# Altium project PCB_EMG_SN.PrjPcb
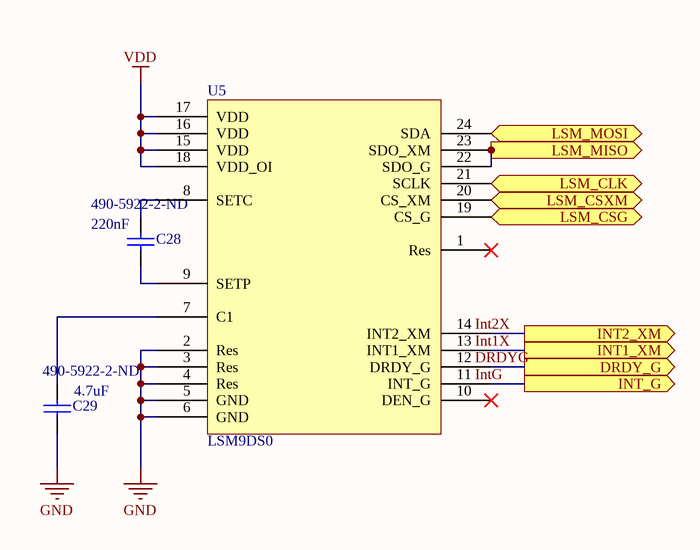
[diagram p0: LSM9DS0.SchDoc]
5 sheets, 67 parts. Net scope: flat (ports and power ports of the same name join across sheets).
Board file: PCB_EMG_SN.PcbDoc
Sheets:
  LSM9DS0.SchDoc
  nRF24L01.SchDoc
  PMU.SchDoc
  AFE_ADS1298.SchDoc
  MCU_MSP430F5529IPN.SchDoc

## Sheet LSM9DS0.SchDoc
size A4

### Parts
C28  value 220nF  Supplier Part Number 1: 490-5922-2-ND  [0402]  (hidden comment: Cap Semi)
C29  value 4.7uF  Supplier Part Number 1: 490-5922-2-ND  [0402]  (hidden comment: Cap Semi)
U5  Component_1  [PCBComponent_1]  (value not drawn)

### Ports
DRDY_G (out), INT1_XM (out), INT2_XM (out), INT_G (out), LSM_CLK (in), LSM_CSG (in), LSM_CSXM (in), LSM_MISO (out), LSM_MOSI (in)

### Nets
GND: C29.1 U5.2(Res) U5.3(Res) U5.4(Res) U5.5(GND) U5.6(GND)  [project net AGND]
VDD: U5.15(VDD) U5.16(VDD) U5.17(VDD) U5.18(VDD_OI)
NetC28_1: C28.1 U5.9(SETP)
NetC28_2: C28.2 U5.8(SETC)
NetC29_2: C29.2 U5.7(C1)
NetU1_9: U5.14(INT2_XM) ; port INT2_XM
NetU1_10: U5.13(INT1_XM) ; port INT1_XM
NetU1_24: U5.19(CS_G) ; port LSM_CSG
NetU1_27: U5.20(CS_XM) ; port LSM_CSXM
NetU1_37: U5.24(SDA) ; port LSM_MOSI
NetU1_38: U5.22(SDO_G) U5.23(SDO_XM) ; port LSM_MISO
NetU1_39: U5.21(SCLK) ; port LSM_CLK
NetU1_69: U5.12(DRDY_G) ; port DRDY_G
NetU1_70: U5.11(INT_G) ; port INT_G

Not connected (* = marked no-connect by the designer): U5 1(Res)* 10(DEN_G)*

### Notes on the sheet
- Labels drawn without touching a wire or pin: DRDYG, Int1X, Int2X, IntG
- (in symbol Component_1) LSM9DS0

### Library data of the parts
C28 C29 = Cap Semi: Capacitor (Semiconductor SIM Model); Published: 8-Jun-2000; LatestRevisionDate: 29-May-2009; LatestRevisionNote: IPC-7351 Footprint Added.; PackageReference: C1206; Publisher: Altium Limited; PackageDescription: Chip Capacitor; Supplier 1: Digi-Key

## Sheet nRF24L01.SchDoc
size A4
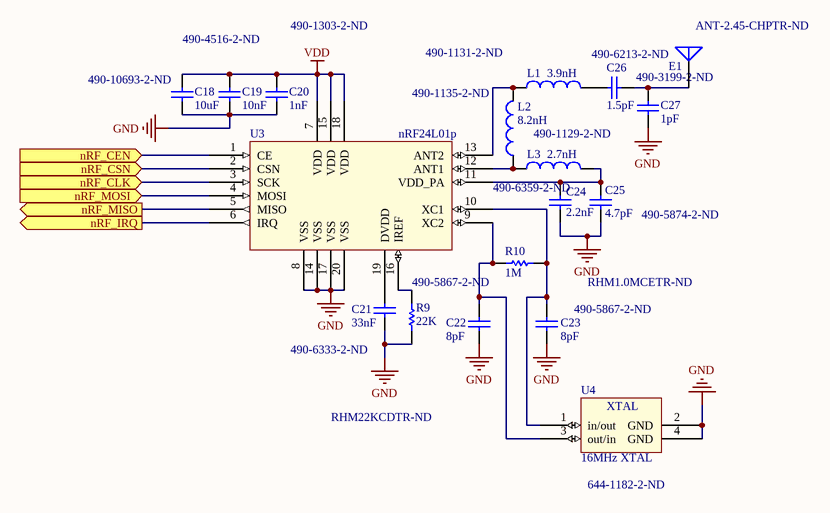
[diagram p1: nRF24L01.SchDoc]

### Parts
C18  value 10uF  Supplier Part Number 1: 490-10693-2-ND  [0402]
C19  value 10nF  Supplier Part Number 1: 490-4516-2-ND  [0402]
C20  value 1nF  Supplier Part Number 1: 490-1303-2-ND  [0402]
C21  value 33nF  Supplier Part Number 1: 490-6333-2-ND  [0402]
C22  value 8pF  Supplier Part Number 1: 490-5867-2-ND  [0402]
C23  value 8pF  Supplier Part Number 1: 490-5867-2-ND  [0402]
C24  value 2.2nF  Supplier Part Number 1: 490-6359-2-ND  [0402]
C25  value 4.7pF  Supplier Part Number 1: 490-5874-2-ND  [0402]
C26  value 1.5pF  Supplier Part Number 1: 490-6213-2-ND  [0402]
C27  value 1pF  Supplier Part Number 1: 490-3199-2-ND  [0402]
E1  Supplier Part Number 1: ANT-2.45-CHPTR-ND  [ANT-2.45-CHP-B]
L1  value 3.9nH  Supplier Part Number 1: 490-1131-2-ND  [0402]
L2  value 8.2nH  Supplier Part Number 1: 490-1135-2-ND  [0402]
L3  value 2.7nH  Supplier Part Number 1: 490-1129-2-ND  [0402]
R9  value 22K  Supplier Part Number 1: RHM22KCDTR-ND  [0402]
R10  value 1M  Supplier Part Number 1: RHM1.0MCETR-ND  [0402]
U3  nRF24L01p  [Component_nRF]
U4  16MHz XTAL  Supplier Part Number 1: 644-1182-2-ND  [8Y-16.000MAAV-T]

### Ports
nRF_CEN (in), nRF_CLK (in), nRF_CSN (in), nRF_IRQ (out), nRF_MISO (out), nRF_MOSI (in)

### Nets
GND: C18.1 C19.1 C20.1 C21.1 C22.1 C23.1 C24.1 C25.1 C27.2 R9.1 U3.8(VSS) U3.14(VSS) U3.17(VSS) U3.20(VSS) U4.2(GND) U4.4(GND)  [project net AGND]
VDD: C18.2 C19.2 C20.2 U3.7(VDD) U3.15(VDD) U3.18(VDD)
NetC21_2: C21.2 U3.19(DVDD)
NetC22_2: C22.2 R10.2 U3.9(XC2) U4.3(out/in)
NetC23_2: C23.2 R10.1 U3.10(XC1) U4.1(in/out)
NetC24_2: C24.2 C25.2 L3.2 U3.11(VDD_PA)
NetC26_1: C26.1 C27.1 E1.1(A)
NetC26_2: C26.2 L1.2
NetL1_1: L1.1 L2.2 U3.13(ANT2)
NetL2_1: L2.1 L3.1 U3.12(ANT1)
NetR9_2: R9.2 U3.16(IREF)
NetU1_32: U3.6(IRQ) ; port nRF_IRQ
NetU1_33: U3.1(CE) ; port nRF_CEN
NetU1_34: U3.2(CSN) ; port nRF_CSN
NetU1_36: U3.3(SCK) ; port nRF_CLK
NetU1_40: U3.4(MOSI) ; port nRF_MOSI
NetU1_41: U3.5(MISO) ; port nRF_MISO

### Notes on the sheet
- (in symbol 8Y-16.000MAAV-T) XTAL

### Library data of the parts
C18-C27 = Cap Semi: Capacitor (Semiconductor SIM Model); Published: 8-Jun-2000; LatestRevisionDate: 29-May-2009; LatestRevisionNote: IPC-7351 Footprint Added.; PackageReference: C1206; Publisher: Altium Limited; PackageDescription: Chip Capacitor; Supplier 1: Digi-Key
E1 = Antenna: Generic Antenna; Published: 24-Mar-1999; LatestRevisionDate: 17-Jul-2002; LatestRevisionNote: Re-released for DXP Platform.; PackageReference: PIN1; Publisher: Altium Limited; Supplier 1: Digi-Key
L1-L3 = Inductor: Code_IEC: 1005; Published: 8-Jun-2000; LatestRevisionDate: 29-May-2009; LatestRevisionNote: IPC-7351 Footprint Added.; PackageReference: 0402-A; Publisher: Altium Limited; PackageDescription: Chip Inductor; Code_JEITA: 0402; Supplier 1: Digi-Key
R9 R10 = Res Semi: Semiconductor Resistor; Published: 8-Jun-2000; LatestRevisionDate: 17-Jul-2002; LatestRevisionNote: Re-released for DXP Platform.; PackageReference: AXIAL-0.5; Publisher: Altium Limited; PackageDescription: Axial Device, Thru-Hole; 2 Leads; 0.5 in Pin Spacing; Supplier 1: Digi-Key
U3 = Component_nRF
U4 = 8Y-16.000MAAV-T: SMD 16 MHz XTAL; Supplier 1: Digi-Key

## Sheet PMU.SchDoc
size A4
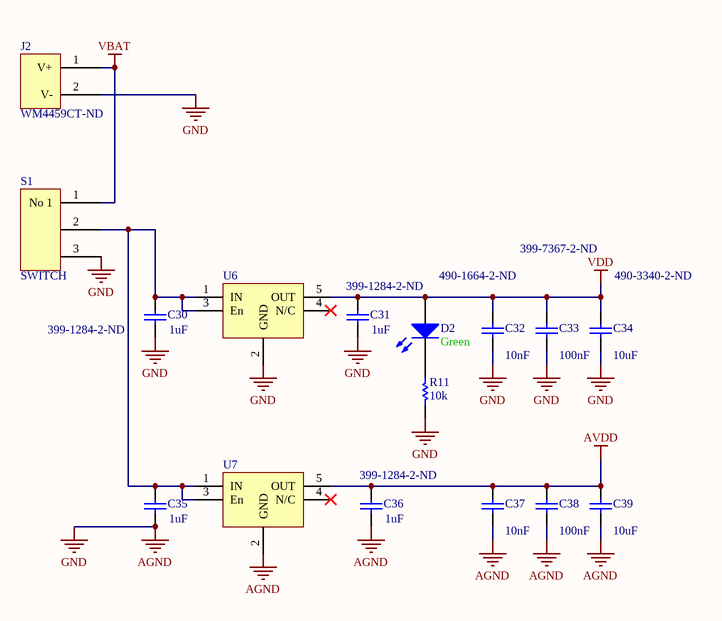
[diagram p2: PMU.SchDoc]

### Parts
C30  value 1uF  Supplier Part Number 1: 399-1284-2-ND  [0402]  (hidden comment: Cap Semi)
C31  value 1uF  Supplier Part Number 1: 399-1284-2-ND  [0402]  (hidden comment: Cap Semi)
C32  value 10nF  Supplier Part Number 1: 490-1664-2-ND  [0402]  (hidden comment: Cap Semi)
C33  value 100nF  Supplier Part Number 1: 399-7367-2-ND  [0402]  (hidden comment: Cap Semi)
C34  value 10uF  Supplier Part Number 1: 490-3340-2-ND  [0402]  (hidden comment: Cap Semi)
C35  value 1uF  [0402]  (hidden comment: Cap Semi)
C36  value 1uF  Supplier Part Number 1: 399-1284-2-ND  [0402]  (hidden comment: Cap Semi)
C37  value 10nF  [0402]  (hidden comment: Cap Semi)
C38  value 100nF  [0402]  (hidden comment: Cap Semi)
C39  value 10uF  [0402]  (hidden comment: Cap Semi)
D2  Color: Green  [0402]
J2  WM4459CT-ND  [WM4459CT-ND]
R11  value 10k  [0402]
S1  SWITCH  [CUS-12B]
U6  Reg 3.3V  [TSOP-5ll]  (value not drawn)
U7  Reg 3.3V  [TSOP-5ll]  (value not drawn)

### Nets
AGND: C30.1 C31.1 C32.1 C33.1 C34.1 C35.1 C36.1 C37.1 C38.1 C39.1 J2.2(V-) R11.2 S1.3 U6.2(GND) U7.2(GND)  [also labelled GND]
AVDD: C36.2 C37.2 C38.2 C39.2 U7.5(OUT)
VBAT: J2.1(V+) S1.1(No_1)
VDD: C31.2 C32.2 C33.2 C34.2 D2.1(A) U6.5(OUT)
NetC30_2: C30.2 C35.2 S1.2 U6.1(IN) U6.3(En) U7.1(IN) U7.3(En)
NetD2_2: D2.2(K) R11.1

Not connected (* = marked no-connect by the designer): U6 4(N/C)*; U7 4(N/C)*

### Library data of the parts
C30-C39 = Cap Semi: Capacitor (Semiconductor SIM Model); Published: 8-Jun-2000; LatestRevisionDate: 29-May-2009; LatestRevisionNote: IPC-7351 Footprint Added.; PackageReference: C1206; Publisher: Altium Limited; PackageDescription: Chip Capacitor; Supplier 1: Digi-Key
  C35: Supplier Part Number 1: 399-1284-2-ND
  C37: Supplier Part Number 1: 490-1664-2-ND
  C38: Supplier Part Number 1: 399-7367-2-ND
  C39: Supplier Part Number 1: 490-3340-2-ND
D2 = LED3: Typical BLUE SiC LED; Published: 8-Jun-2000; LatestRevisionDate: 17-Dec-2003; LatestRevisionNote: PCB Footprint replaced.; DatasheetVersion: 16-Apr-2002; PackageVersion: 16-Apr-2002; PackageReference: 3.5X2.8X1.9; Publisher: Altium Limited; PackageDescription: SM LED; 2 C-Bend Leads; Body 3.5 x 2.8 x 1.9 mm, inc leads (LxWxH typ)
R11 = Res Semi: Semiconductor Resistor; Published: 8-Jun-2000; LatestRevisionDate: 17-Jul-2002; LatestRevisionNote: Re-released for DXP Platform.; PackageReference: AXIAL-0.5; Publisher: Altium Limited; PackageDescription: Axial Device, Thru-Hole; 2 Leads; 0.5 in Pin Spacing
S1 = Component_1
U6 U7 = NCP603SN330T1G: IC REG LDO 3.3V 0.3A 5TSOP; Supplier 1: Digi-Key; Supplier Part Number 1: NCP603SN330T1GOSCT-ND

## Sheet AFE_ADS1298.SchDoc
size A4
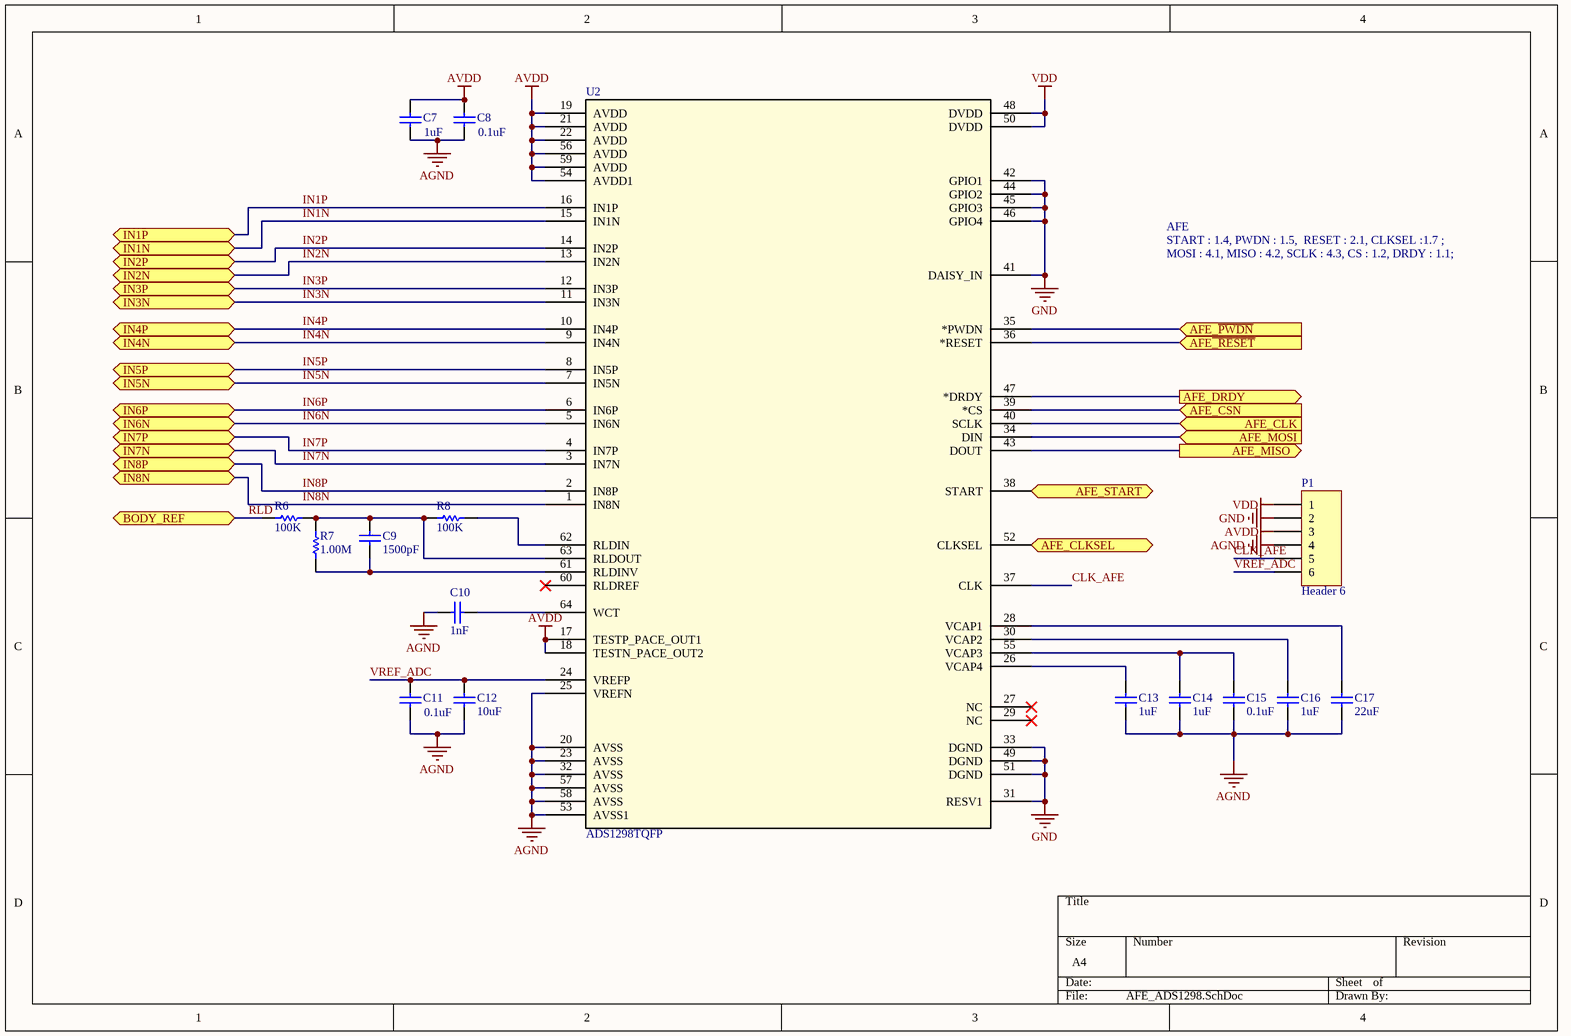
[diagram p3: AFE_ADS1298.SchDoc]

### Parts
C7  value 1uF  [0402]  (hidden comment: Cap)
C8  value 0.1uF  [0402]  (hidden comment: Cap)
C9  value 1500pF  [0402]  (hidden comment: Cap)
C10  value 1nF  [0402]  (hidden comment: Cap)
C11  value 0.1uF  [0402]  (hidden comment: Cap)
C12  value 10uF  [0402]
C13  value 1uF  [0402]  (hidden comment: Cap)
C14  value 1uF  [0402]  (hidden comment: Cap)
C15  value 0.1uF  [0402]  (hidden comment: Cap)
C16  value 1uF  [0402]  (hidden comment: Cap)
C17  value 22uF  [0402]  (hidden comment: Cap)
P1  Header 6  [HDR1X6]
R6  value 100K  [0402]  (hidden comment: Res1)
R7  value 1.00M  [0402]  (hidden comment: Res1)
R8  value 100K  [0402]  (hidden comment: Res1)
U2  ADS1298TQFP  [64TQFP]

### Ports
AFE_CLK (in), AFE_CLKSEL (in), AFE_CSN (in), AFE_DRDY (out), AFE_MISO (out), AFE_MOSI (in), AFE_START (in), AFE_~{PWDN} (in), AFE~{_RESET} (in), BODY_REF (bidir), IN1N (bidir), IN1P (bidir), IN2N (bidir), IN2P (bidir), IN3N (bidir), IN3P (bidir), IN4N (bidir), IN4P (bidir), IN5N (bidir), IN5P (bidir), IN6N (bidir), IN6P (bidir), IN7N (bidir), IN7P (bidir), IN8N (bidir), IN8P (bidir)

### Nets
AGND: C7.1 C8.1 C10.2 C11.1 C12.1 C13.2 C14.2 C15.2 C16.2 C17.2 P1.2 P1.4 U2.20(AVSS) U2.23(AVSS) U2.25(VREFN) U2.31(RESV1) U2.32(AVSS) U2.33(DGND) U2.41(DAISY_IN) U2.42(GPIO1) U2.44(GPIO2) U2.45(GPIO3) U2.46(GPIO4) U2.49(DGND) U2.51(DGND) U2.53(AVSS1) U2.57(AVSS) U2.58(AVSS)  [also labelled GND]
AVDD: C7.2 C8.2 P1.3 U2.17(TESTP_PACE_OUT1) U2.18(TESTN_PACE_OUT2) U2.19(AVDD) U2.21(AVDD) U2.22(AVDD) U2.54(AVDD1) U2.56(AVDD) U2.59(AVDD)
VDD: P1.1 U2.48(DVDD) U2.50(DVDD)
CLK_AFE: P1.5 U2.37(CLK)
IN1N: U2.15(IN1N) ; port IN1N
IN1P: U2.16(IN1P) ; port IN1P
IN2N: U2.13(IN2N) ; port IN2N
IN2P: U2.14(IN2P) ; port IN2P
IN3N: U2.11(IN3N) ; port IN3N
IN3P: U2.12(IN3P) ; port IN3P
IN4N: U2.9(IN4N) ; port IN4N
IN4P: U2.10(IN4P) ; port IN4P
IN5N: U2.7(IN5N) ; port IN5N
IN5P: U2.8(IN5P) ; port IN5P
IN6N: U2.5(IN6N) ; port IN6N
IN6P: U2.6(IN6P) ; port IN6P
IN7N: U2.3(IN7N) ; port IN7N
IN7P: U2.4(IN7P) ; port IN7P
IN8N: U2.1(IN8N) ; port IN8N
IN8P: U2.2(IN8P) ; port IN8P
RLD: R6.2 ; port BODY_REF
VREF_ADC: C11.2 C12.2 P1.6 U2.24(VREFP)
NetC9_1: C9.1 R7.2 U2.61(RLDINV)
NetC9_2: C9.2 R6.1 R7.1 R8.2 U2.63(RLDOUT)
NetC10_1: C10.1 U2.64(WCT)
NetC13_1: C13.1 U2.26(VCAP4)
NetC14_1: C14.1 C15.1 U2.55(VCAP3)
NetC16_1: C16.1 U2.30(VCAP2)
NetC17_1: C17.1 U2.28(VCAP1)
NetR8_1: R8.1 U2.62(RLDIN)
NetU1_22: U2.47(*DRDY) ; port AFE_DRDY
NetU1_23: U2.39(*CS) ; port AFE_CSN
NetU1_25: U2.38(START) ; port AFE_START
NetU1_26: U2.35(*PWDN) ; port AFE_~{PWDN}
NetU1_28: U2.52(CLKSEL) ; port AFE_CLKSEL
NetU1_30: U2.36(*RESET) ; port AFE~{_RESET}
NetU1_46: U2.34(DIN) ; port AFE_MOSI
NetU1_47: U2.43(DOUT) ; port AFE_MISO
NetU1_48: U2.40(SCLK) ; port AFE_CLK

Not connected (* = marked no-connect by the designer): U2 27(NC)* 29(NC)* 60(RLDREF)*

### Notes on the sheet
- AFE
- START : 1.4, PWDN : 1.5,  RESET : 2.1, CLKSEL :1.7 ;
- MOSI : 4.1, MISO : 4.2, SCLK : 4.3, CS : 1.2, DRDY : 1.1;

### Library data of the parts
C7-C11 C13-C17 = Cap: Capacitor
C12 = Cap Semi: Capacitor (Semiconductor SIM Model)
P1 = Header 6: Header, 6-Pin; LatestRevisionDate: 17-Jul-2002; LatestRevisionNote: Re-released for DXP Platform.; Publisher: Altium Limited
R6-R8 = Res1: Resistor
U2 = ADS1298_PAG_64: Imported; Manufacturer: Texas Instruments; INDUSTRY_STD_PKG_TYPE: TQFP; FAMILY_NAME: ECG / EEG Analog Front End; PIN_COUNT: 64; PACKAGE_DESIGNATOR: PAG; Datasheet URL: http://www.ti.com/lit/gpn/ADS1298; GENERIC_PART_NUMBER: ADS1298; RefDes: RefDes; Type: DEV; Value: Value

## Sheet MCU_MSP430F5529IPN.SchDoc
size A4
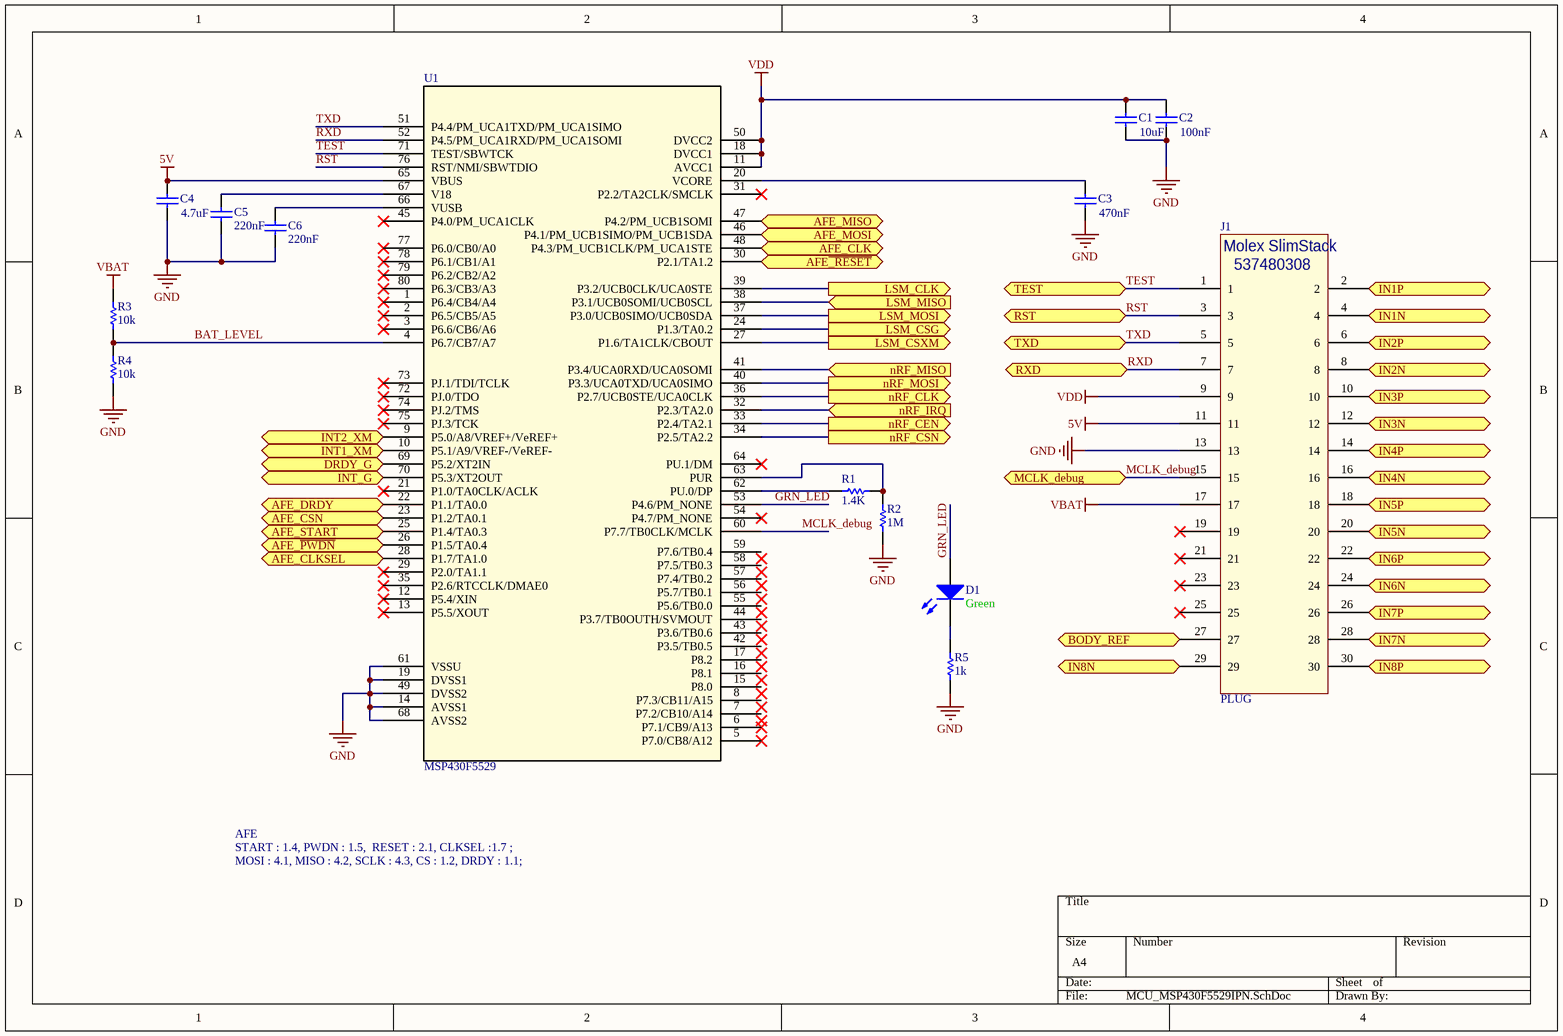
[diagram p4: MCU_MSP430F5529IPN.SchDoc]

### Parts
C1  value 10uF  [0402]  (hidden comment: Cap Semi)
C2  value 100nF  [0402]  (hidden comment: Cap Semi)
C3  value 470nF  [0402]  (hidden comment: Cap Semi)
C4  value 4.7uF  [0402]  (hidden comment: Cap Semi)
C5  value 220nF  [0402]  (hidden comment: Cap Semi)
C6  value 220nF  [0402]  (hidden comment: Cap Semi)
D1  Color: Green  [0402]
J1  PLUG  [Molex 0529910308]
R1  value 1.4K  [0402]
R2  value 1M  [0402]
R3  value 10k  [0402]
R4  value 10k  [0402]
R5  value 1k  [0402]
U1  MSP430F5529  [80-LQFP]

### Ports
AFE_CLK (out), AFE_CLKSEL (out), AFE_CSN (out), AFE_DRDY (in), AFE_MISO (in), AFE_MOSI (out), AFE_START (out), AFE_~{PWDN} (out), AFE~{_RESET} (out), BODY_REF (bidir), DRDY_G (in), IN1N (bidir), IN1P (bidir), IN2N (bidir), IN2P (bidir), IN3N (bidir), IN3P (bidir), IN4N (bidir), IN4P (bidir), IN5N (bidir), IN5P (bidir), IN6N (bidir), IN6P (bidir), IN7N (bidir), IN7P (bidir), IN8N (bidir), IN8P (bidir), INT1_XM (in), INT2_XM (in), INT_G (in), LSM_CLK (out), LSM_CSG (out), LSM_CSXM (out), LSM_MISO (in), LSM_MOSI (out), MCLK_debug (bidir), nRF_CEN (out), nRF_CLK (out), nRF_CSN (out), nRF_IRQ (in), nRF_MISO (in), nRF_MOSI (out), RST (bidir), RXD (bidir), TEST (bidir), TXD (bidir)

### Nets
5V: C4.1 J1.11 U1.65(VBUS)
GND: C1.2 C2.2 C3.2 C4.2 C5.1 C6.1 J1.13 R2.2 R4.1 R5.2 U1.14(AVSS1) U1.19(DVSS1) U1.49(DVSS2) U1.61(VSSU) U1.68(AVSS2)  [project net AGND]
VBAT: J1.17 R3.2
VDD: C1.1 C2.1 J1.9 U1.11(AVCC1) U1.18(DVCC1) U1.50(DVCC2)
BAT_LEVEL: R3.1 R4.2 U1.4(P6.7/CB7/A7)
GRN_LED: D1.1(A) U1.53(P4.6/PM_NONE)
IN1N: J1.4 ; port IN1N
IN1P: J1.2 ; port IN1P
IN2N: J1.8 ; port IN2N
IN2P: J1.6 ; port IN2P
IN3N: J1.12 ; port IN3N
IN3P: J1.10 ; port IN3P
IN4N: J1.16 ; port IN4N
IN4P: J1.14 ; port IN4P
IN5N: J1.20 ; port IN5N
IN5P: J1.18 ; port IN5P
IN6N: J1.24 ; port IN6N
IN6P: J1.22 ; port IN6P
IN7N: J1.28 ; port IN7N
IN7P: J1.26 ; port IN7P
IN8N: J1.29 ; port IN8N
IN8P: J1.30 ; port IN8P
MCLK_debug: J1.15 U1.60(P7.7/TB0CLK/MCLK) ; port MCLK_debug
RLD: J1.27 ; port BODY_REF
RST: J1.3 U1.76(RST/NMI/SBWTDIO) ; port RST
RXD: J1.7 U1.52(P4.5/PM_UCA1RXD/PM_UCA1SOMI) ; port RXD
TEST: J1.1 U1.71(TEST/SBWTCK) ; port TEST
TXD: J1.5 U1.51(P4.4/PM_UCA1TXD/PM_UCA1SIMO) ; port TXD
NetC3_1: C3.1 U1.20(VCORE)
NetC5_2: C5.2 U1.67(V18)
NetC6_2: C6.2 U1.66(VUSB)
NetD1_2: D1.2(K) R5.1
NetR1_1: R1.1 R2.1 U1.63(PUR)
NetR1_2: R1.2 U1.62(PU.0/DP)
NetU1_9: U1.9(P5.0/A8/VREF+/VeREF+) ; port INT2_XM
NetU1_10: U1.10(P5.1/A9/VREF-/VeREF-) ; port INT1_XM
NetU1_22: U1.22(P1.1/TA0.0) ; port AFE_DRDY
NetU1_23: U1.23(P1.2/TA0.1) ; port AFE_CSN
NetU1_24: U1.24(P1.3/TA0.2) ; port LSM_CSG
NetU1_25: U1.25(P1.4/TA0.3) ; port AFE_START
NetU1_26: U1.26(P1.5/TA0.4) ; port AFE_~{PWDN}
NetU1_27: U1.27(P1.6/TA1CLK/CBOUT) ; port LSM_CSXM
NetU1_28: U1.28(P1.7/TA1.0) ; port AFE_CLKSEL
NetU1_30: U1.30(P2.1/TA1.2) ; port AFE~{_RESET}
NetU1_32: U1.32(P2.3/TA2.0) ; port nRF_IRQ
NetU1_33: U1.33(P2.4/TA2.1) ; port nRF_CEN
NetU1_34: U1.34(P2.5/TA2.2) ; port nRF_CSN
NetU1_36: U1.36(P2.7/UCB0STE/UCA0CLK) ; port nRF_CLK
NetU1_37: U1.37(P3.0/UCB0SIMO/UCB0SDA) ; port LSM_MOSI
NetU1_38: U1.38(P3.1/UCB0SOMI/UCB0SCL) ; port LSM_MISO
NetU1_39: U1.39(P3.2/UCB0CLK/UCA0STE) ; port LSM_CLK
NetU1_40: U1.40(P3.3/UCA0TXD/UCA0SIMO) ; port nRF_MOSI
NetU1_41: U1.41(P3.4/UCA0RXD/UCA0SOMI) ; port nRF_MISO
NetU1_46: U1.46(P4.1/PM_UCB1SIMO/PM_UCB1SDA) ; port AFE_MOSI
NetU1_47: U1.47(P4.2/PM_UCB1SOMI) ; port AFE_MISO
NetU1_48: U1.48(P4.3/PM_UCB1CLK/PM_UCA1STE) ; port AFE_CLK
NetU1_69: U1.69(P5.2/XT2IN) ; port DRDY_G
NetU1_70: U1.70(P5.3/XT2OUT) ; port INT_G

Not connected (* = marked no-connect by the designer): J1 19* 21* 23* 25*; U1 1(P6.4/CB4/A4)* 2(P6.5/CB5/A5)* 3(P6.6/CB6/A6)* 5(P7.0/CB8/A12)* 6(P7.1/CB9/A13)* 7(P7.2/CB10/A14) 8(P7.3/CB11/A15) 12(P5.4/XIN)* 13(P5.5/XOUT)* 15(P8.0) 16(P8.1) 17(P8.2) 21(P1.0/TA0CLK/ACLK)* 29(P2.0/TA1.1)* 31(P2.2/TA2CLK/SMCLK)* 35(P2.6/RTCCLK/DMAE0)* 42(P3.5/TB0.5) 43(P3.6/TB0.6) 44(P3.7/TB0OUTH/SVMOUT) 45(P4.0/PM_UCA1CLK)* 54(P4.7/PM_NONE)* 55(P5.6/TB0.0) 56(P5.7/TB0.1) 57(P7.4/TB0.2) 58(P7.5/TB0.3) 59(P7.6/TB0.4) 64(PU.1/DM)* 72(PJ.0/TDO)* 73(PJ.1/TDI/TCLK)* 74(PJ.2/TMS)* 75(PJ.3/TCK)* 77(P6.0/CB0/A0)* 78(P6.1/CB1/A1)* 79(P6.2/CB2/A2)* 80(P6.3/CB3/A3)*

### Notes on the sheet
- AFE
- START : 1.4, PWDN : 1.5,  RESET : 2.1, CLKSEL :1.7 ;
- MOSI : 4.1, MISO : 4.2, SCLK : 4.3, CS : 1.2, DRDY : 1.1;
- (in symbol Molex 529910308) Molex SlimStack; 537480308

### Library data of the parts
C1-C6 = Cap Semi: Capacitor (Semiconductor SIM Model); Published: 8-Jun-2000; LatestRevisionDate: 29-May-2009; LatestRevisionNote: IPC-7351 Footprint Added.; PackageReference: C1206; Publisher: Altium Limited; PackageDescription: Chip Capacitor; Supplier 1: Digi-Key
  C1 C2: Supplier Part Number 1: 490-10692-2-ND
  C3: Supplier Part Number 1: 1276-1734-2-ND
  C4: Supplier Part Number 1: 490-5915-2-ND
  C5 C6: Supplier Part Number 1: 490-3884-2-ND
D1 = LED3: Typical BLUE SiC LED; Published: 8-Jun-2000; LatestRevisionDate: 17-Dec-2003; LatestRevisionNote: PCB Footprint replaced.; DatasheetVersion: 16-Apr-2002; PackageVersion: 16-Apr-2002; PackageReference: 3.5X2.8X1.9; Publisher: Altium Limited; PackageDescription: SM LED; 2 C-Bend Leads; Body 3.5 x 2.8 x 1.9 mm, inc leads (LxWxH typ)
J1 = Molex 529910308
R1-R5 = Res Semi: Semiconductor Resistor; Published: 8-Jun-2000; LatestRevisionDate: 17-Jul-2002; LatestRevisionNote: Re-released for DXP Platform.; PackageReference: AXIAL-0.5; Publisher: Altium Limited; PackageDescription: Axial Device, Thru-Hole; 2 Leads; 0.5 in Pin Spacing; Supplier 1: Digi-Key
  R1 R3 R4: Supplier Part Number 1: RHM1.4KBHTR-ND
  R2: Supplier Part Number 1: RHM1.00MCDTR-ND
  R5: Supplier Part Number 1: RHM100CDTR-ND
U1 = MSP430F5529: IC MCU 16BIT 128KB FLASH 80LQFP; Supplier 1: Digi-Key; Supplier Part Number 1: 296-25427-ND

## Nets that join several sheets
AGND: LSM9DS0 (6 pins), nRF24L01 (16 pins), PMU (15 pins), AFE_ADS1298 (28 pins), MCU_MSP430F5529IPN (15 pins)
AVDD: PMU (5 pins), AFE_ADS1298 (11 pins)
VBAT: PMU (J2.1 S1.1), MCU_MSP430F5529IPN (J1.17 R3.2)
VDD: LSM9DS0 (U5.15 U5.16 U5.17 U5.18), nRF24L01 (6 pins), PMU (6 pins), AFE_ADS1298 (P1.1 U2.48 U2.50), MCU_MSP430F5529IPN (6 pins)
IN1N: AFE_ADS1298 (U2.15), MCU_MSP430F5529IPN (J1.4)
IN1P: AFE_ADS1298 (U2.16), MCU_MSP430F5529IPN (J1.2)
IN2N: AFE_ADS1298 (U2.13), MCU_MSP430F5529IPN (J1.8)
IN2P: AFE_ADS1298 (U2.14), MCU_MSP430F5529IPN (J1.6)
IN3N: AFE_ADS1298 (U2.11), MCU_MSP430F5529IPN (J1.12)
IN3P: AFE_ADS1298 (U2.12), MCU_MSP430F5529IPN (J1.10)
IN4N: AFE_ADS1298 (U2.9), MCU_MSP430F5529IPN (J1.16)
IN4P: AFE_ADS1298 (U2.10), MCU_MSP430F5529IPN (J1.14)
IN5N: AFE_ADS1298 (U2.7), MCU_MSP430F5529IPN (J1.20)
IN5P: AFE_ADS1298 (U2.8), MCU_MSP430F5529IPN (J1.18)
IN6N: AFE_ADS1298 (U2.5), MCU_MSP430F5529IPN (J1.24)
IN6P: AFE_ADS1298 (U2.6), MCU_MSP430F5529IPN (J1.22)
IN7N: AFE_ADS1298 (U2.3), MCU_MSP430F5529IPN (J1.28)
IN7P: AFE_ADS1298 (U2.4), MCU_MSP430F5529IPN (J1.26)
IN8N: AFE_ADS1298 (U2.1), MCU_MSP430F5529IPN (J1.29)
IN8P: AFE_ADS1298 (U2.2), MCU_MSP430F5529IPN (J1.30)
NetU1_9: LSM9DS0 (U5.14), MCU_MSP430F5529IPN (U1.9)
NetU1_10: LSM9DS0 (U5.13), MCU_MSP430F5529IPN (U1.10)
NetU1_22: AFE_ADS1298 (U2.47), MCU_MSP430F5529IPN (U1.22)
NetU1_23: AFE_ADS1298 (U2.39), MCU_MSP430F5529IPN (U1.23)
NetU1_24: LSM9DS0 (U5.19), MCU_MSP430F5529IPN (U1.24)
NetU1_25: AFE_ADS1298 (U2.38), MCU_MSP430F5529IPN (U1.25)
NetU1_26: AFE_ADS1298 (U2.35), MCU_MSP430F5529IPN (U1.26)
NetU1_27: LSM9DS0 (U5.20), MCU_MSP430F5529IPN (U1.27)
NetU1_28: AFE_ADS1298 (U2.52), MCU_MSP430F5529IPN (U1.28)
NetU1_30: AFE_ADS1298 (U2.36), MCU_MSP430F5529IPN (U1.30)
NetU1_32: nRF24L01 (U3.6), MCU_MSP430F5529IPN (U1.32)
NetU1_33: nRF24L01 (U3.1), MCU_MSP430F5529IPN (U1.33)
NetU1_34: nRF24L01 (U3.2), MCU_MSP430F5529IPN (U1.34)
NetU1_36: nRF24L01 (U3.3), MCU_MSP430F5529IPN (U1.36)
NetU1_37: LSM9DS0 (U5.24), MCU_MSP430F5529IPN (U1.37)
NetU1_38: LSM9DS0 (U5.22 U5.23), MCU_MSP430F5529IPN (U1.38)
NetU1_39: LSM9DS0 (U5.21), MCU_MSP430F5529IPN (U1.39)
NetU1_40: nRF24L01 (U3.4), MCU_MSP430F5529IPN (U1.40)
NetU1_41: nRF24L01 (U3.5), MCU_MSP430F5529IPN (U1.41)
NetU1_46: AFE_ADS1298 (U2.34), MCU_MSP430F5529IPN (U1.46)
NetU1_47: AFE_ADS1298 (U2.43), MCU_MSP430F5529IPN (U1.47)
NetU1_48: AFE_ADS1298 (U2.40), MCU_MSP430F5529IPN (U1.48)
NetU1_69: LSM9DS0 (U5.12), MCU_MSP430F5529IPN (U1.69)
NetU1_70: LSM9DS0 (U5.11), MCU_MSP430F5529IPN (U1.70)
RLD: AFE_ADS1298 (R6.2), MCU_MSP430F5529IPN (J1.27)